# EAGLE design working (EAGLE 6.5.0)
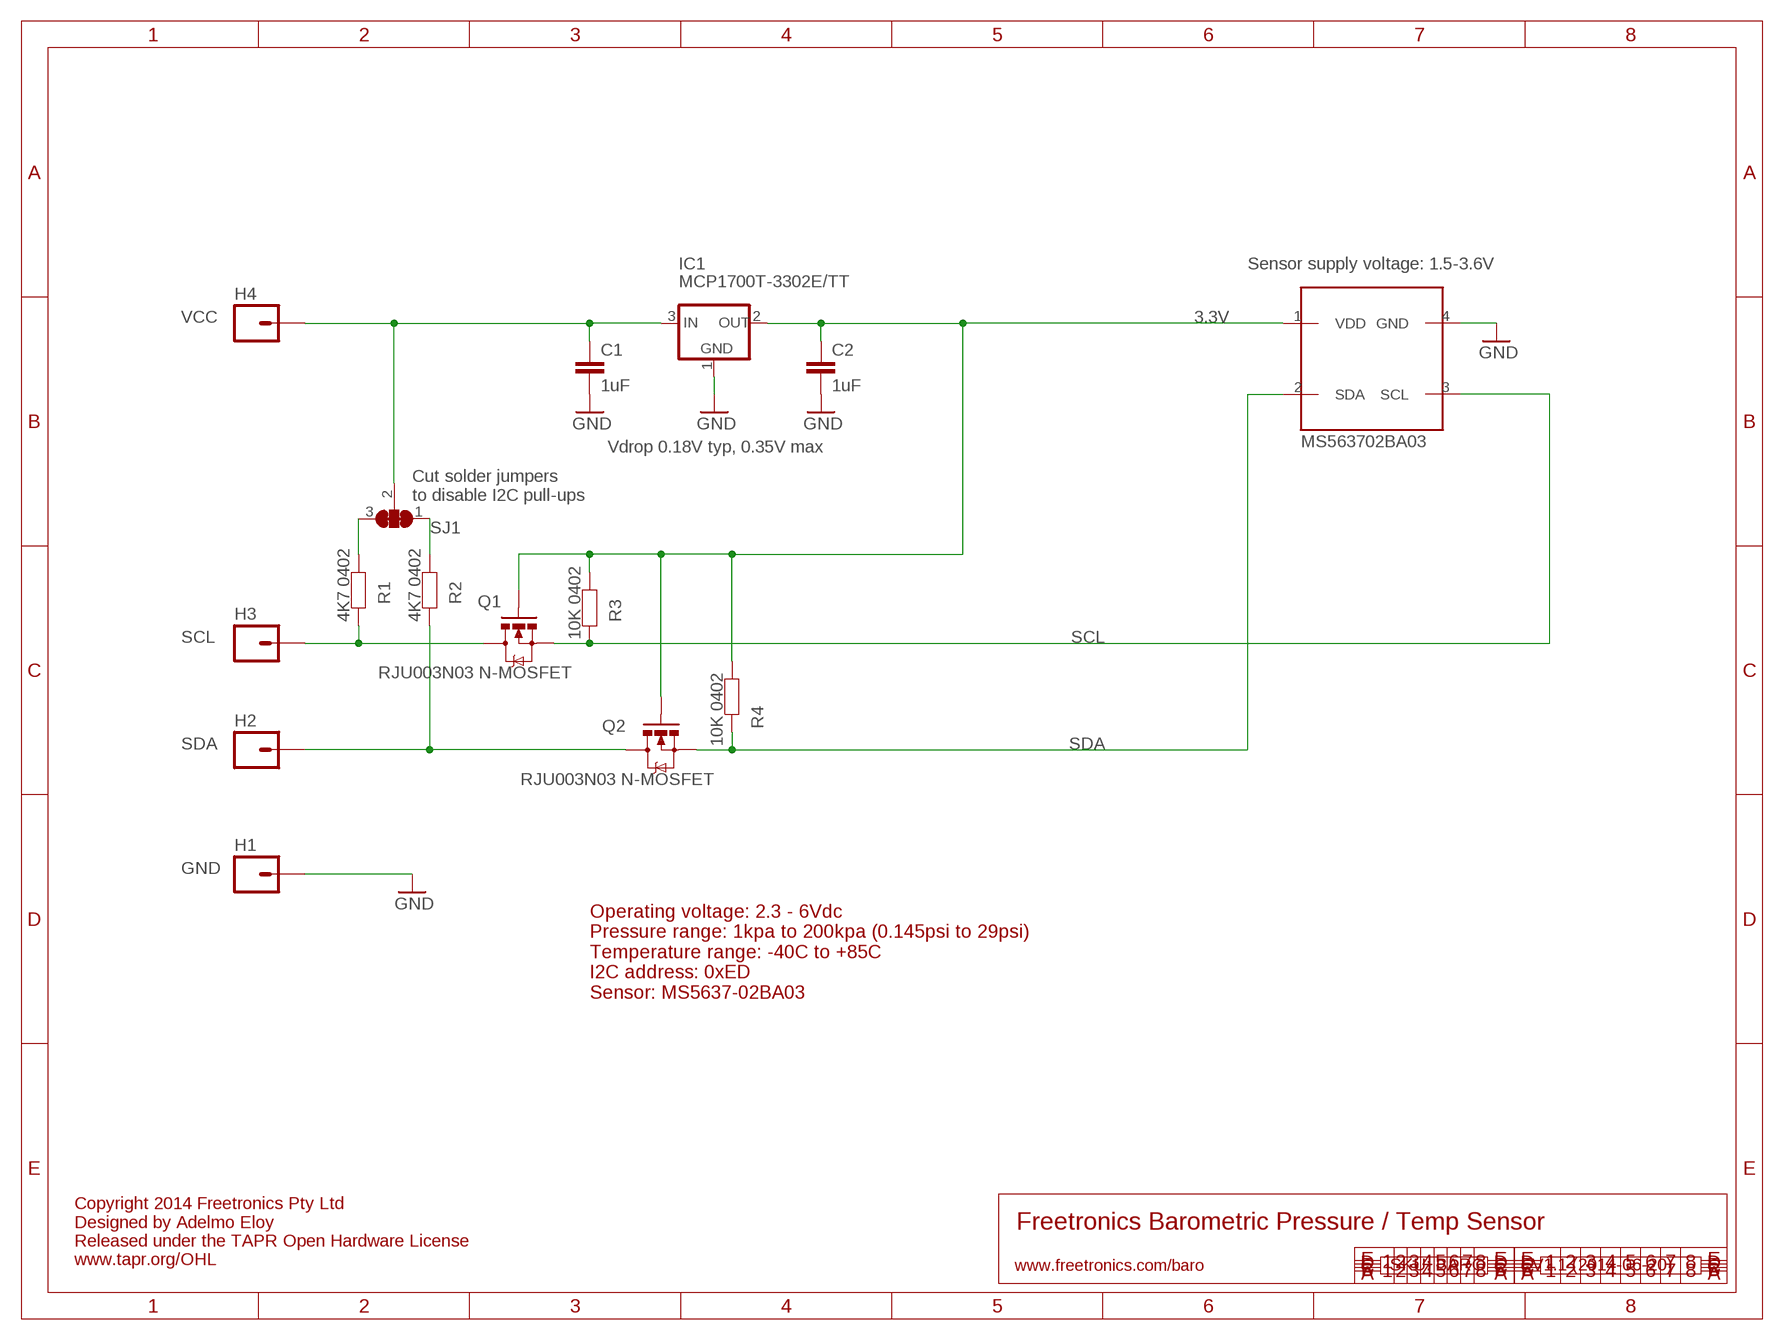
[diagram p0: schematic, sheet 1]

## Parts
C1  1uF  CAP0603  [0603]
C2  1uF  CAP0603  [0603]
H1  GND  M01PTH  [1X01]
H2  SDA  M01PTH  [1X01]
H3  SCL  M01PTH  [1X01]
H4  VCC  M01PTH  [1X01]
IC1  MCP1700T-3302E/TT  V_REG_78XXSOT23-3  [SOT23-3]
IC2  MS563702BA03  [MS5637]
Q1  RJU003N03 N-MOSFET  MOSFET-NSOT-323  [SOT32-3]
Q2  RJU003N03 N-MOSFET  MOSFET-NSOT-323  [SOT32-3]
R1  4K7 0402  RESISTOR0402  [0402]
R2  4K7 0402  RESISTOR0402  [0402]
R3  10K 0402  RESISTOR0402  [0402]
R4  10K 0402  RESISTOR0402  [0402]
SJ1  SJ2W  [SJ_2]

## Nets
3.3V: C2.1 IC1.2(OUT) IC2.1(VDD) Q1.1(G) Q2.1(G) R3.2 R4.2
GND: C1.2 C2.2 H1.1 IC1.1(GND) IC2.4(GND)
N$1: IC2.3(SCL) Q1.2(S) R3.1
N$3: C1.1 H4.1 IC1.3(IN) SJ1.2
N$4: IC2.2(SDA) Q2.2(S) R4.1
N$5: R1.2 SJ1.3
N$6: R2.2 SJ1.1
SCL: H3.1 Q1.3(D) R1.1
SDA: H2.1 Q2.3(D) R2.1

## Notes on the sheet
- Sensor supply voltage: 1.5-3.6V
- Vdrop 0.18V typ, 0.35V max
- Cut solder jumpers 
  to disable I2C pull-ups
- Operating voltage: 2.3 - 6Vdc
  Pressure range: 1kpa to 200kpa (0.145psi to 29psi)
  Temperature range: -40C to +85C
  I2C address: 0xED
  Sensor: MS5637-02BA03
- Freetronics Barometric Pressure / Temp Sensor
- Copyright 2014 Freetronics Pty Ltd
  Designed by Adelmo Eloy
  Released under the TAPR Open Hardware License
  www.tapr.org/OHL
- www.freetronics.com/baro | SKU: BARO | V1.1 (2014-06-20)

## Library data of the parts
C1 C2 = freetronics-master-v1:CAP: Capacitor Standard 0603 ceramic capacitor, and 0.1" leaded capacitor.
H1-H4 = freetronics-master-v1.1:M01: Header 1 Standard 1-pin 0.1" header. Use with straight break away headers (SKU : PRT-00116), right angle break away headers (PRT-00553), swiss pins (PRT-00743), machine pins (PRT-00117), and female headers (PRT-00115).
IC1 = freetronics-master-v1:V_REG_78XX
IC2 = freetronics-original:MS5637
Q1 Q2 = freetronics-jon:MOSFET-N: Basic N-Channel MOSFET
R1-R4 = freetronics-jon:RESISTOR: Resistor Basic schematic elements and footprints for 0603, 1206, and PTH 1/10th watt (small) resistors.
SJ1 = freetronics-master-v1.1:SJ2W: SMD solder JUMPER

## Board
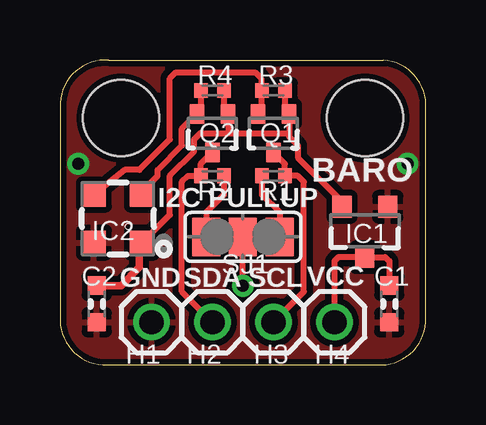
[diagram p1: board, top side]
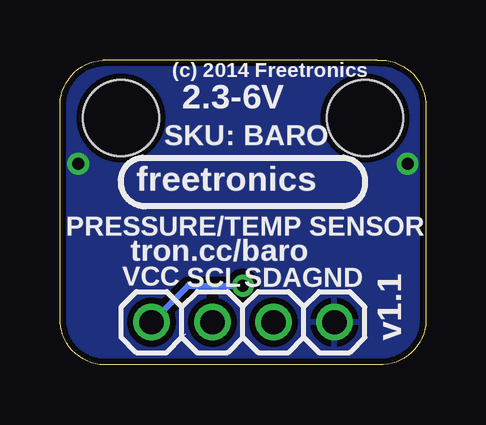
[diagram p2: board, bottom side, seen from below]

Size 15.25 x 12.71 mm. Coordinates in mm from the lower left corner, seen from the top.
Outline: 0,2.04 arc90 1.78,0 13.21,0 arc90 15.24,1.78 15.24,10.67 arc90 13.47,12.7 2.04,12.7 arc90 0,10.93 0,2.04
Copper layers (1*16): Top 0.035mm / dielectric 1.5mm / Bottom 0.035mm
Design rules "default *": minimum track width 8mil, minimum drill 15mil, track to track 10mil, track to pad 10mil, pad to pad 10mil, via to via 10mil, smd to smd 8mil, copper to edge 10mil, drill to drill 8mil, minimum pad ring 10mil, minimum via ring 8mil, stop-mask expansion 4mil, vias tented up to drill 25mil, thermal gap 10mil
Holes 3.17 mm at 12.7,10.29 2.54,10.29

### Footprints (pad centres in the part's own frame; a part is rotated, then mirrored left to right if it is on the bottom)
0603 = smd 0.762 x 0.762: 1 -0.762,0; 2 0.762,0
1X01 = drill 1.016: 1 0,0
SOT23-3 = smd 0.8 x 0.9: 1 -0.95,-1; 2 0.95,-1; 3 0,1.1
MS5637 = smd 1 x 1: 1 -1,1; 2 -1,-1; 3 1,-1; 4 1,1
SOT32-3 = smd 0.6 x 0.8: 1 -0.65,-0.8; 2 0.65,-0.8; 3 0,0.8
0402 = smd 0.571 x 0.62: 1 -0.48,0; 2 0.48,0
SJ_2 = smd 1.168 x 1.6: 1 -1.524,0; 2 0,0; 3 1.524,0

### Placement (x,y rotation side)
C1  13.72,2.54 270 top
C2  1.53,2.54 270 top
H1  3.81,1.78 270 top
H2  6.35,1.78 270 top
H3  8.89,1.78 270 top
H4  11.43,1.78 270 top
IC1  12.7,5.59 180 top
IC2  2.42,6.1 180 top
Q1  8.89,9.66 180 top
Q2  6.35,9.66 180 top
R1  8.89,7.88 180 top
R2  6.35,7.88 0 top
R3  8.89,11.43 0 top
R4  6.35,11.43 0 top
SJ1  7.62,5.34 0 top

### Tracks (layer width: path | path; a pad name or v marks a point on that pad's centre or on a via)
3.3V
  Top 0.254: R3.2 9.37,10.63 Q1.1 9.54,9.66 | 7,9.66 5.85,9.66 5.59,9.4 5.59,8.89 4.58,7.88 4.58,6.26 IC2.1 | 7,9.66 9.54,9.66 | 7,9.66 Q2.1 6.83,10.46 R4.2 | 9.54,9.66 9.54,9.51 9.91,9.15 9.91,8.64 11.75,6.8 IC1.2
  Top 0.305: C2.1 2.54,3.31 3.31,4.07 3.31,4.99 IC2.1
GND  (via drill 0.5)
  other vias: 0.77,8.39 14.48,8.39
  pour Top: 1.88,12.7 13.41,12.7 arc-90 15.24,10.87 15.24,1.83 arc-90 13.41,0 1.71,0 arc-90 0,1.71 0,10.82 arc-90
  pour Bottom: 1.78,12.7 13.54,12.7 arc-91 15.24,10.36 15.24,1.64 arc-89 13.48,0 1.78,0 arc-90 0,1.78 0,10.93 arc-90
N$1
  Top 0.254: Q1.2 8.41,10.46 R3.1 8.39,11.46 8.39,11.94 8.13,12.2 4.83,12.2 4.58,11.94 4.58,9.4 3.31,8.13 2.7,8.13 IC2.3 1.43,6.86
N$2
  Top 0.203: 6.61,5.34 7.12,5.34
N$3  (via drill 0.5)
  Top 0.254: 11.43,1.95 H4.1 11.43,4.32 11.6,4.49 IC1.3 13.55,4.49 13.72,4.32 C1.1 | v7.62,3.31 SJ1.2
  Bottom 0.254: H4.1 9.91,3.31 v7.62,3.31
N$4
  Top 0.254: IC2.2 3.42,7.15 3.6,7.41 4.07,7.88 4.07,8.13 5.08,9.15 5.08,9.84 Q2.2 5.87,10.63 R4.1
N$5
  Top 0.254: R1.2 8.41,7.09 9.15,6.35 SJ1.3
N$6
  Top 0.254: 6.35,5.59 SJ1.1 6.1,6.35 6.83,7.09 R2.2
N$7
  Top 0.203: 8.13,5.34 8.64,5.34
SCL
  Top 0.254: Q1.3 9.37,8.38 R1.1 9.91,7.88 10.16,7.62 10.16,3.05 H3.1
SDA
  Top 0.254: Q2.3 5.87,8.38 R2.1 5.34,7.88 5.08,7.62 5.08,3.05 H2.1

### Text on the board
tPlace: BARO | I2C PULLUP | GND | SDA | SCL | VCC
bPlace: (c) 2014 Freetronics | 2.3-6V | SKU: BARO | freetronics | PRESSURE/TEMP SENSOR | v1.1 | GND | SDA | SCL | VCC | tron.cc/baro